# EAGLE design beaconBoard (EAGLE 6.5.0)
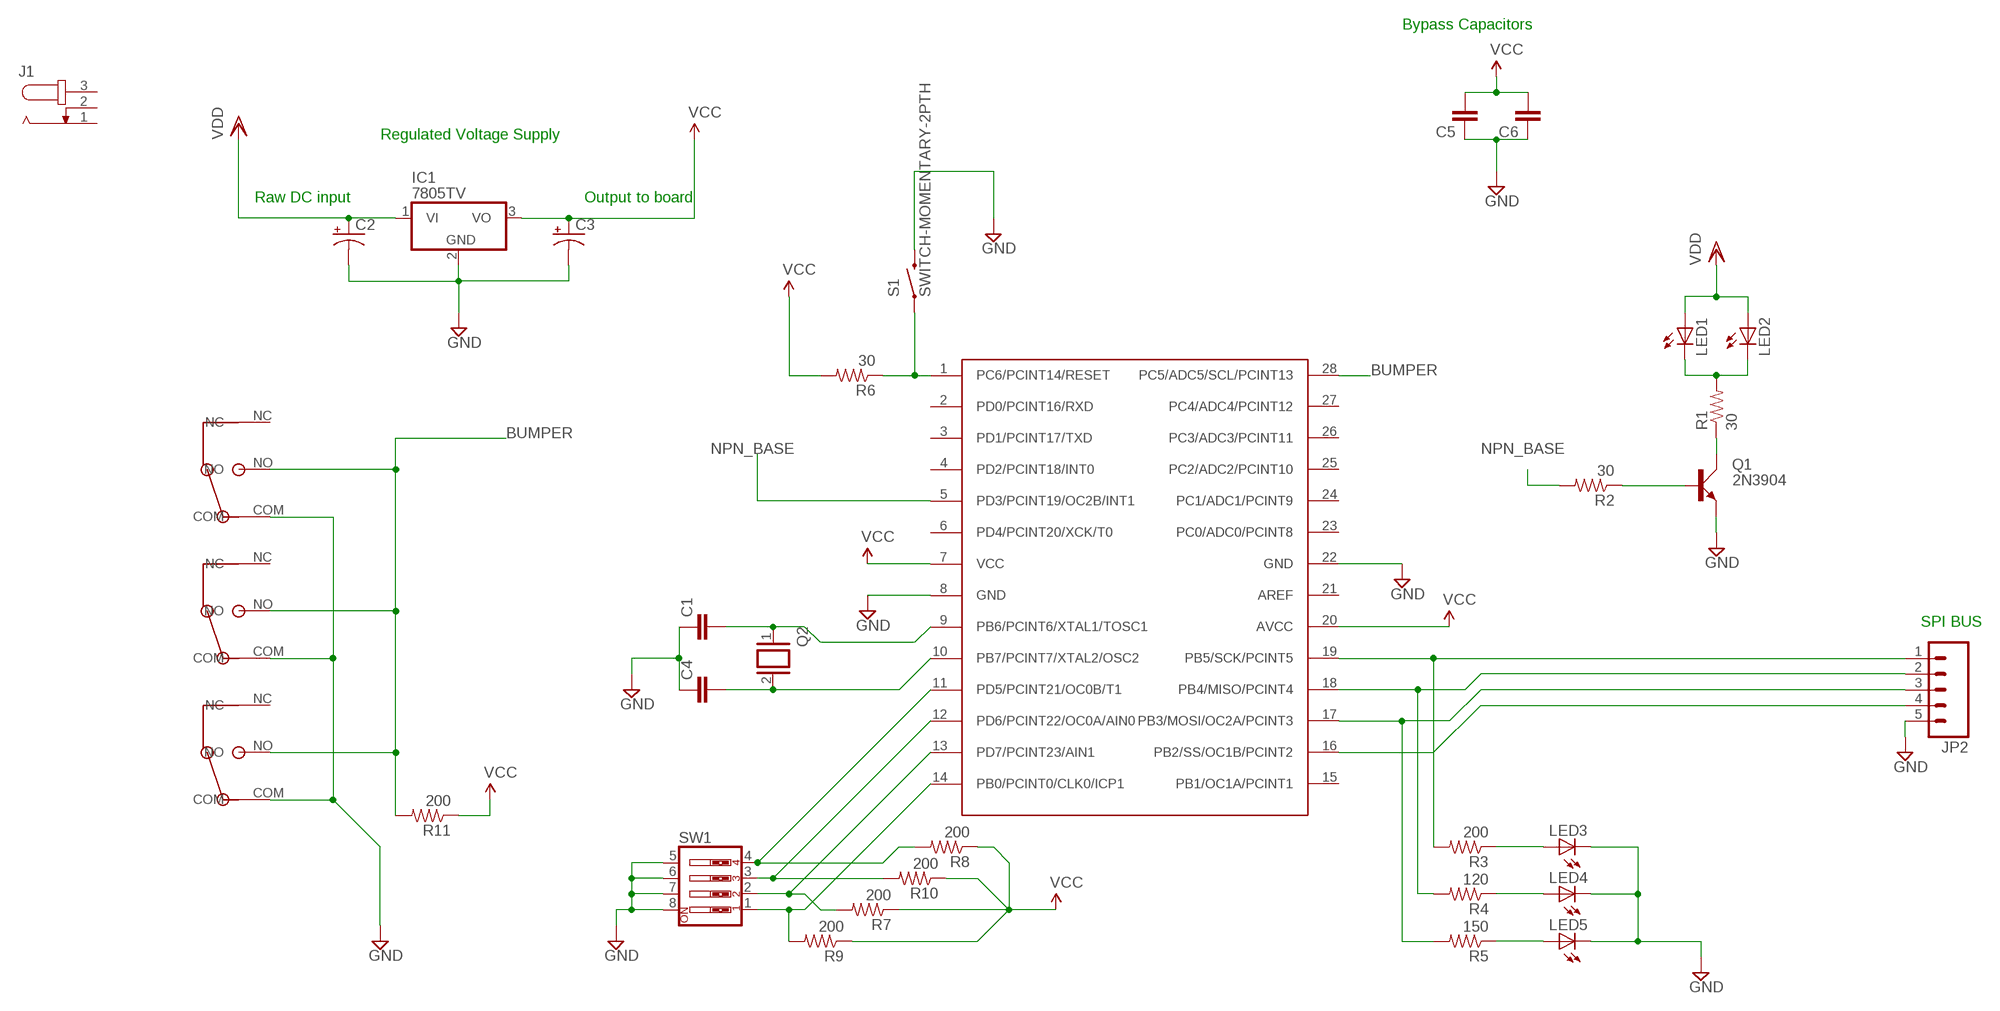
[diagram p0: schematic, sheet 1]

## Parts
C1  CAPPTH  [CAP-PTH-SMALL]
C2  CAP_POLPTH2  [CPOL-RADIAL-10UF-25V]
C3  CAP_POLPTH2  [CPOL-RADIAL-10UF-25V]
C4  CAPPTH  [CAP-PTH-SMALL]
C5  CAPPTH  [CAP-PTH-SMALL]
C6  CAPPTH  [CAP-PTH-SMALL]
IC1  7805TV  [TO220V]
J1  JACK-PLUG1  [SPC4078]
JP2  M05LOCK_LONGPADS  [1X05_LOCK_LONGPADS]
LED1  LED-2AC-CP41B-WES  [CP41B]
LED2  LED-2AC-CP41B-WES  [CP41B]
LED3  LED5MM  [LED5MM]
LED4  LED5MM  [LED5MM]
LED5  LED5MM  [LED5MM]
Q1  2N3904  [TO92D]
Q2  XTAL/S  [QS]
R1  30  RESISTORPTH-1/4W  [AXIAL-0.4]
R2  30  RESISTORPTH-1/4W  [AXIAL-0.4]
R3  200  RESISTORPTH-1/4W  [AXIAL-0.4]
R4  120  RESISTORPTH-1/4W  [AXIAL-0.4]
R5  150  RESISTORPTH-1/4W  [AXIAL-0.4]
R6  30  RESISTORPTH-1/4W  [AXIAL-0.4]
R7  200  RESISTORPTH-1/4W  [AXIAL-0.4]
R8  200  RESISTORPTH-1/4W  [AXIAL-0.4]
R9  200  RESISTORPTH-1/4W  [AXIAL-0.4]
R10  200  RESISTORPTH-1/4W  [AXIAL-0.4]
R11  200  RESISTORPTH-1/4W  [AXIAL-0.4]
S1  SWITCH-MOMENTARY-2PTH  [TACTILE-PTH]
SW1  SW_DIP-4  [EDG-04]
U$1  DF2-L  [D2F-L]
U$2  DF2-L  [D2F-L]
U$3  DF2-L  [D2F-L]
U$4  ATMEGA328  [DIL28-3]

## Nets
BUMPER: R11.P$2 U$1.NO U$2.NO U$3.NO U$4.28(PC5/ADC5/SCL/PCINT13)
GND: C1.1 C2.2(-) C3.2(-) C4.1 C5.1 C6.1 IC1.2(GND) JP2.5 LED3.K(C) LED4.K(C) LED5.K(C) Q1.E S1.3 SW1.5 SW1.6 SW1.7 SW1.8 U$1.COM U$2.COM U$3.COM U$4.8(GND) U$4.22(GND)
N$1: Q1.C R1.P$1
N$2: Q1.B R2.P$1
N$3: LED1.1(C) LED1.4(C) LED2.1(C) LED2.4(C) R1.P$2
N$5: JP2.1 R3.P$2 U$4.19(PB5/SCK/PCINT5)
N$6: JP2.2 R4.P$2 U$4.18(PB4/MISO/PCINT4)
N$7: JP2.3 R5.P$2 U$4.17(PB3/MOSI/OC2A/PCINT3)
N$8: LED3.A R3.P$1
N$9: LED4.A R4.P$1
N$10: LED5.A R5.P$1
N$11: R6.P$1 S1.1 U$4.1(PC6/PCINT14/RESET)
N$12: C1.2 Q2.1 U$4.9(PB6/PCINT6/XTAL1/TOSC1)
N$13: C4.2 Q2.2 U$4.10(PB7/PCINT7/XTAL2/OSC2)
N$14: R7.P$2 SW1.2 U$4.13(PD7/PCINT23/AIN1)
N$15: R8.P$2 SW1.4 U$4.11(PD5/PCINT21/OC0B/T1)
N$16: R10.P$2 SW1.3 U$4.12(PD6/PCINT22/OC0A/AIN0)
N$19: R9.P$2 SW1.1 U$4.14(PB0/PCINT0/CLK0/ICP1)
N$20: JP2.4 U$4.16(PB2/SS/OC1B/PCINT2)
NPN_BASE: R2.P$2 U$4.5(PD3/PCINT19/OC2B/INT1)
VCC: C3.1(+) C5.2 C6.2 IC1.3(VO) R6.P$2 R7.P$1 R8.P$1 R9.P$1 R10.P$1 R11.P$1 U$4.7(VCC) U$4.20(AVCC)
VDD: C2.1(+) IC1.1(VI) LED1.2(A) LED1.3(A) LED2.2(A) LED2.3(A)
Unconnected: J1.1 J1.2 J1.3 U$1.NC U$2.NC U$3.NC U$4.2(PD0/PCINT16/RXD) U$4.3(PD1/PCINT17/TXD) U$4.4(PD2/PCINT18/INT0) U$4.6(PD4/PCINT20/XCK/T0) U$4.15(PB1/OC1A/PCINT1) U$4.21(AREF) U$4.23(PC0/ADC0/PCINT8) U$4.24(PC1/ADC1/PCINT9) U$4.25(PC2/ADC2/PCINT10) U$4.26(PC3/ADC3/PCINT11) U$4.27(PC4/ADC4/PCINT12)

## Notes on the sheet
- Bypass Capacitors
- Regulated Voltage Supply
- Raw DC input | Output to board
- SPI BUS

## Library data of the parts
C1 C4-C6 = SparkFun-Passives:CAP: Capacitor Standard 0603 ceramic capacitor, and 0.1" leaded capacitor.
C2 C3 = SparkFun-Capacitors:CAP_POL: Capacitor Polarized These are standard SMD and PTH capacitors. Normally 10uF, 47uF, and 100uF in electrolytic and tantalum varieties. Always verify the external diameter of the through hole cap, it varies with capacity, voltage, and manufacturer. The EIA devices should be standard.
IC1 = linear:78*: Positive VOLTAGE REGULATOR Source: http://cache.national.com/ds/LM/LM78L05.pdf http://www.fairchildsemi.com/ds/LM/LM7805.pdf
J1 = con-jack:JACK-PLUG: DC POWER JACK Power Jack, DC, Right Angle, Through Hole, Rated 5A at 16VDC, PC Terminals Distributor: Farnell (www.Farnell.de) Drawing: 84N1161.pdf / 84N1162.pdf Manufacturer: SPC Technology (www.spctechnology.com) Type: SPC4077 / SPC 4078; OC_FARNELL: unknown; OC_NEWARK: unknown
JP2 = SparkFun-Connectors:M05: Header 5 Standard 5-pin 0.1" header. Use with straight break away headers (SKU : PRT-00116), right angle break away headers (PRT-00553), swiss pins (PRT-00743), machine pins (PRT-00117), and female headers (PRT-00115). Molex polarized connector foot print use with SKU : PRT-08230 with associated crimp pins and housings.
LED1 LED2 = led:LED-2AC-: LEDs with 2 Cathode & 2 Anode - Kingbright SUPER FLUX LED LAMP Source: www.us.kingbright.com/images/catalog/SPEC/W7676CPBC-H.pdf Cree® P4 LED CP41B-WES/WGS Source: Data sheet <http://www.cree.com/products/pdf/LEDlamps/CP41B-WES&WGS.pdf>
LED3-LED5 = SparkFun-LED:LED: LEDs Standard schematic elements and footprints for 5mm, 3mm, 1206, and 0603 sized LEDs. 5mm - Spark Fun Electronics SKU : COM-00529 (and others)
Q1 = transistor-small-signal:2N3904: NPN TRANSISTOR
Q2 = special:XTAL/S: CRYSTAL
R1-R11 = SparkFun-Resistors:RESISTOR: Resistor Basic schematic elements and footprints for 0603, 1206, and PTH resistors.
S1 = SparkFun-Electromechanical:SWITCH-MOMENTARY-2: Various NO switches- pushbuttons, reed, etc
SW1 = special:SW_DIP-4: DIP SWITCH
U$1-U$3 = hmcfabstudio:DF2-L
U$4 = hmcfabstudio:ATMEGA328: Atmega328 in a DIL28 package with pin names taken from the datasheet.

## Board
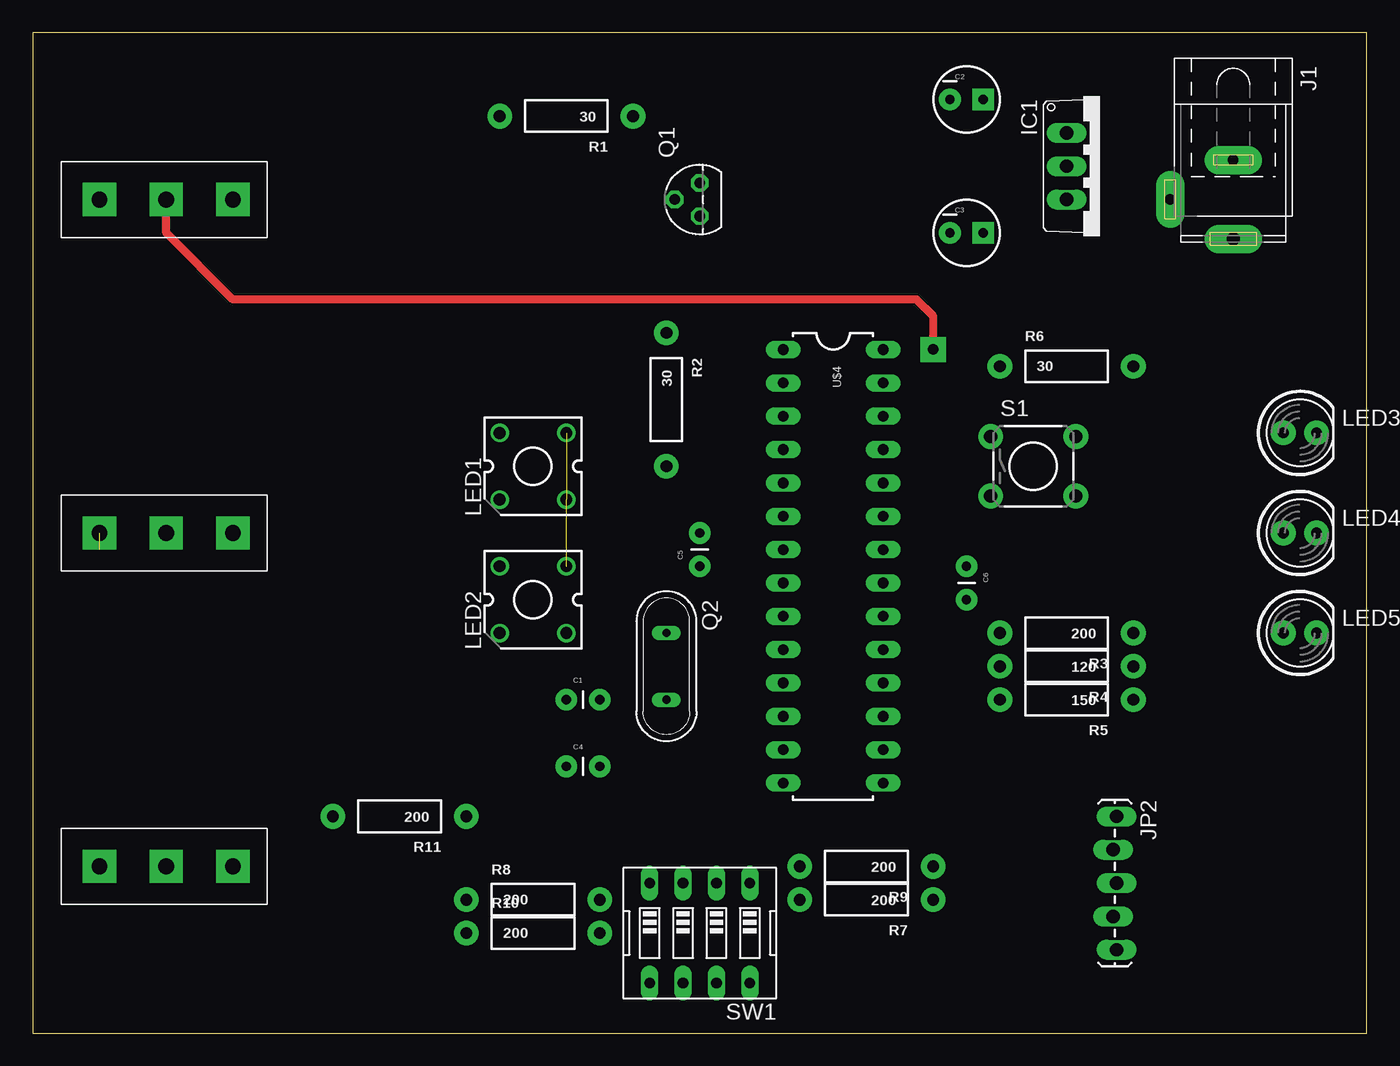
[diagram p1: board, top side]
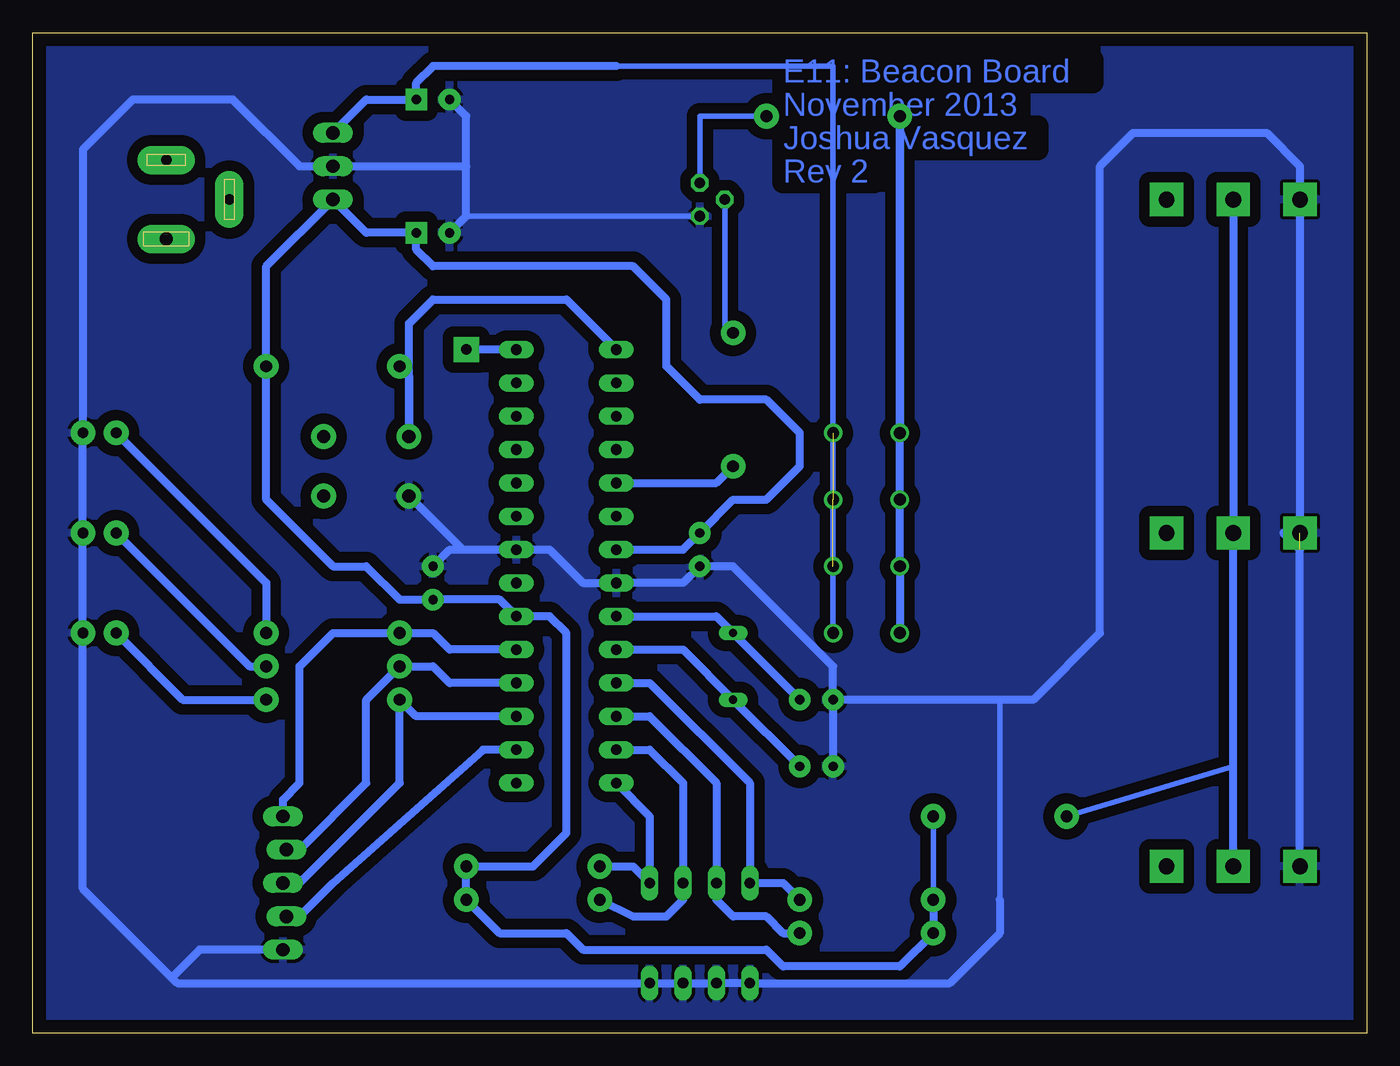
[diagram p2: board, bottom side, seen from below]

Size 101.6 x 76.2 mm. Coordinates in mm from the lower left corner, seen from the top.
Outline: 0,0 101.6,0 101.6,76.2 0,76.2 0,0
Copper layers (1*16): Top 0.035mm / dielectric 1.5mm / Bottom 0.035mm
Design rules "default": minimum track width 10mil, minimum drill 24mil, track to track 8mil, track to pad 8mil, pad to pad 8mil, via to via 8mil, smd to smd 8mil, copper to edge 40mil, drill to drill 8mil, minimum pad ring 10mil, minimum via ring 8mil, stop-mask expansion 4mil, vias tented up to drill 0mil, thermal gap 10mil

### Footprints (pad centres in the part's own frame; a part is rotated, then mirrored left to right if it is on the bottom)
CAP-PTH-SMALL = drill 0.7 pad 1.651: 1 0,0; 2 2.54,0
CPOL-RADIAL-10UF-25V = drill 0.7 pad 1.651 square: 1 1.27,0 | drill 0.7 pad 1.651: 2 -1.27,0
TO220V = drill 1.016 long: 1 -2.54,-2.54; 2 0,-2.54; 3 2.54,-2.54
SPC4078 = drill 0.8 pad 2.184 long: 1 -3,0; 2 0,-4.8 | drill 1 pad 2.184 long: 3 3,0
1X05_LOCK_LONGPADS = drill 1.016 long: 1 0,0; 2 2.54,-0.254; 3 5.08,0; 4 7.62,-0.254; 5 10.16,0
CP41B = drill 0.9 pad 1.27: 1 -2.54,2.54; 2 -2.54,-2.54; 3 2.54,-2.54; 4 2.54,2.54
LED5MM = drill 0.813 pad 1.88: A -1.27,0; K 1.27,0
TO92D = drill 0.813 octagon: B 0,1.905; C 1.27,0; E -1.27,0
QS = drill 0.61 long: 1 -2.54,0; 2 2.54,0
AXIAL-0.4 = drill 0.9 pad 1.88: P$1 -5.08,0; P$2 5.08,0
TACTILE-PTH = drill 1.016 pad 1.88: 1 -3.251,2.261; 2 3.251,2.261; 3 -3.251,-2.261; 4 3.251,-2.261
EDG-04 = drill 0.813 long: 1 -3.81,-3.81; 2 -1.27,-3.81; 3 1.27,-3.81; 4 3.81,-3.81; 5 3.81,3.81; 6 1.27,3.81; 7 -1.27,3.81; 8 -3.81,3.81
D2F-L = drill 1.2 pad 2.54 square: COM 0,0; NC 10.16,0; NO 5.08,0
DIL28-3 = drill 0.813 long: 1 -16.51,-3.81; 2 -13.97,-3.81; 3 -11.43,-3.81; 4 -8.89,-3.81; 5 -6.35,-3.81; 6 -3.81,-3.81; 7 -1.27,-3.81; 8 1.27,-3.81; 9 3.81,-3.81; 10 6.35,-3.81; 11 8.89,-3.81; 12 11.43,-3.81; 13 13.97,-3.81; 14 16.51,-3.81; 15 16.51,3.81; 16 13.97,3.81; 17 11.43,3.81; 18 8.89,3.81; 19 6.35,3.81; 20 3.81,3.81; 21 1.27,3.81; 22 -1.27,3.81; 23 -3.81,3.81; 24 -6.35,3.81; 25 -8.89,3.81; 26 -11.43,3.81; 27 -13.97,3.81; 28 -16.51,3.81

### Placement (x,y rotation side)
C1  40.64,25.4 0 top
C2  71.12,71.12 0 top
C3  71.12,60.96 0 top
C4  40.64,20.32 0 top
C5  50.8,35.56 90 top
C6  71.12,35.56 270 top
IC1  81.28,66.04 270 top
J1  91.44,63.5 270 top
JP2  82.55,16.51 270 top
LED1  38.1,43.18 90 top
LED2  38.1,33.02 90 top
LED3  96.52,45.72 0 top
LED4  96.52,38.1 0 top
LED5  96.52,30.48 0 top
Q1  50.8,63.5 90 top
Q2  48.26,27.94 270 top
R1  40.64,69.85 180 top
R2  48.26,48.26 270 top
R3  78.74,30.48 180 top
R4  78.74,27.94 180 top
R5  78.74,25.4 180 top
R6  78.74,50.8 0 top
R7  63.5,10.16 180 top
R8  38.1,10.16 0 top
R9  63.5,12.7 180 top
R10  38.1,7.62 0 top
R11  27.94,16.51 180 top
S1  76.2,43.18 0 top
SW1  50.8,7.62 180 top
U$1  5.08,63.5 0 top
U$2  5.08,12.7 0 top
U$3  5.08,38.1 0 top
U$4  60.96,35.56 270 top

### Tracks (layer width: path | path; a pad name or v marks a point on that pad's centre or on a via)
BUMPER  (via drill 0.8 pad 1.93)
  Top 0.61: v68.58,52.07 68.58,54.61 67.31,55.88 15.24,55.88 10.16,60.96 U$1.NO
  Bottom 0.406: R11.P$2 10.16,20.32
  Bottom 0.61: U$2.NO 10.16,20.32 U$3.NO U$1.NO | U$4.28 v68.58,52.07
GND  (1 unrouted)
  Bottom 0.406: Q1.E 68.58,62.23 | 27.94,10.16 27.94,25.4
  Bottom 0.61: 68.58,66.04 IC1.2 81.28,66.04 86.36,71.12 93.98,71.12 97.79,67.31 LED3.K LED4.K LED5.K 97.79,11 91.02,4.23 | 68.58,66.04 68.58,69.85 C2.2 | C3.2 68.58,62.23 68.58,66.04 | S1.3 68.86,36.83 | 68.86,36.83 U$4.22 62.23,36.83 59.69,34.29 U$4.8 52.07,34.29 C5.1 48.26,35.56 40.64,27.94 C1.1 | C6.1 69.85,36.83 68.86,36.83 | C1.1 27.94,25.4 25.4,25.4 20.32,30.48 20.32,66.04 17.78,68.58 7.62,68.58 5.08,66.04 U$1.COM U$3.COM | C1.1 C4.1 | 27.94,10.16 27.94,7.62 31.75,3.81 SW1.5 SW1.6 SW1.7 SW1.8 90.6,3.81 91.02,4.23 | JP2.5 88.9,6.35 91.02,4.23 | U$2.COM 5.08,36.83 6.35,38.1
  pour Bottom (isolate 0.813): 0,76.2 101.6,76.2 101.6,0 0,0
N$1
  Bottom 0.406: R1.P$1 50.8,69.85 Q1.C
N$2
  Bottom 0.406: R2.P$1 48.9,53.34 Q1.B
N$3
  Bottom 0.61: LED1.4 R1.P$2 LED1.1 LED2.4 LED2.1
N$5
  Bottom 0.61: U$4.19 69.85,29.21 71.12,30.48 R3.P$2 78.74,30.48 81.28,27.94 81.28,19.05 82.55,17.78 JP2.1
N$6
  Bottom 0.61: U$4.18 69.85,26.67 71.12,27.94 R4.P$2 76.2,25.4 76.2,19.05 81.28,13.97 JP2.2
N$7
  Bottom 0.61: U$4.17 72.39,24.13 R5.P$2 73.66,19.05 81.28,11.43 JP2.3
N$8
  Bottom 0.61: LED3.A 83.82,34.29 R3.P$1
N$9
  Bottom 0.61: LED4.A 85.09,27.94 R4.P$1
N$10
  Bottom 0.61: LED5.A 90.17,25.4 R5.P$1
N$11
  Bottom 0.61: R6.P$1 72.95,50.09 S1.1 72.95,54.05 71.12,55.88 60.96,55.88 U$4.1
N$12
  Bottom 0.61: U$4.9 49.53,31.75 Q2.1 C1.2
N$13
  Bottom 0.61: U$4.10 52.07,29.21 Q2.2 C4.2
N$14
  Bottom 0.61: U$4.13 54.61,21.59 52.07,19.05 SW1.2 52.07,10.16 53.34,8.89 55.88,8.89 R7.P$2
N$15
  Bottom 0.61: U$4.11 54.61,26.67 46.99,19.05 SW1.4 44.45,11.43 R8.P$2
N$16
  Bottom 0.61: U$4.12 54.61,24.13 49.53,19.05 SW1.3 49.53,10.16 48.26,8.89 45.72,8.89 44.45,7.62 R10.P$2
N$19
  Bottom 0.61: U$4.14 54.61,16.51 SW1.1 55.88,12.7 R9.P$2
N$20
  Bottom 0.61: U$4.16 67.31,21.59 78.74,11.43 81.28,8.89 JP2.4
NPN_BASE
  Bottom 0.61: U$4.5 49.53,41.91 R2.P$2
VCC
  Bottom 0.406: R11.P$1 R10.P$1
  Bottom 0.61: U$4.7 52.07,36.83 C5.2 48.26,40.64 45.72,40.64 43.18,43.18 43.18,45.72 45.72,48.26 50.8,48.26 53.34,50.8 53.34,55.88 55.88,58.42 71.12,58.42 72.39,59.69 C3.1 76.2,60.96 IC1.3 83.82,58.42 R6.P$2 83.82,40.64 78.74,35.56 76.2,35.56 73.66,33.02 C6.2 66.04,33.02 U$4.20 62.23,31.75 60.96,30.48 60.96,15.24 63.5,12.7 R9.P$1 R7.P$1 66.04,7.62 60.96,7.62 59.69,6.35 45.72,6.35 44.45,5.08 35.56,5.08 R10.P$1 R8.P$1
VDD  (2 unrouted)
  Bottom 0.406: LED2.2 LED1.3 40.64,73.66 60.96,73.66
  Bottom 0.61: IC1.1 76.2,71.12 C2.1 72.39,72.39 71.12,73.66 60.96,73.66 57.15,73.66

### Text on the board
Bottom: E11: Beacon Board | November 2013 | Joshua Vasquez | Rev 2